# EasyEDA schematic SCH_NetStream_Caravel.json
TITLE: Sheet_1; REV: 1.0; Date: 2026-05-01; Sheet: 1/1; Drawn By: chetansk.241ee214; Company: Your Company
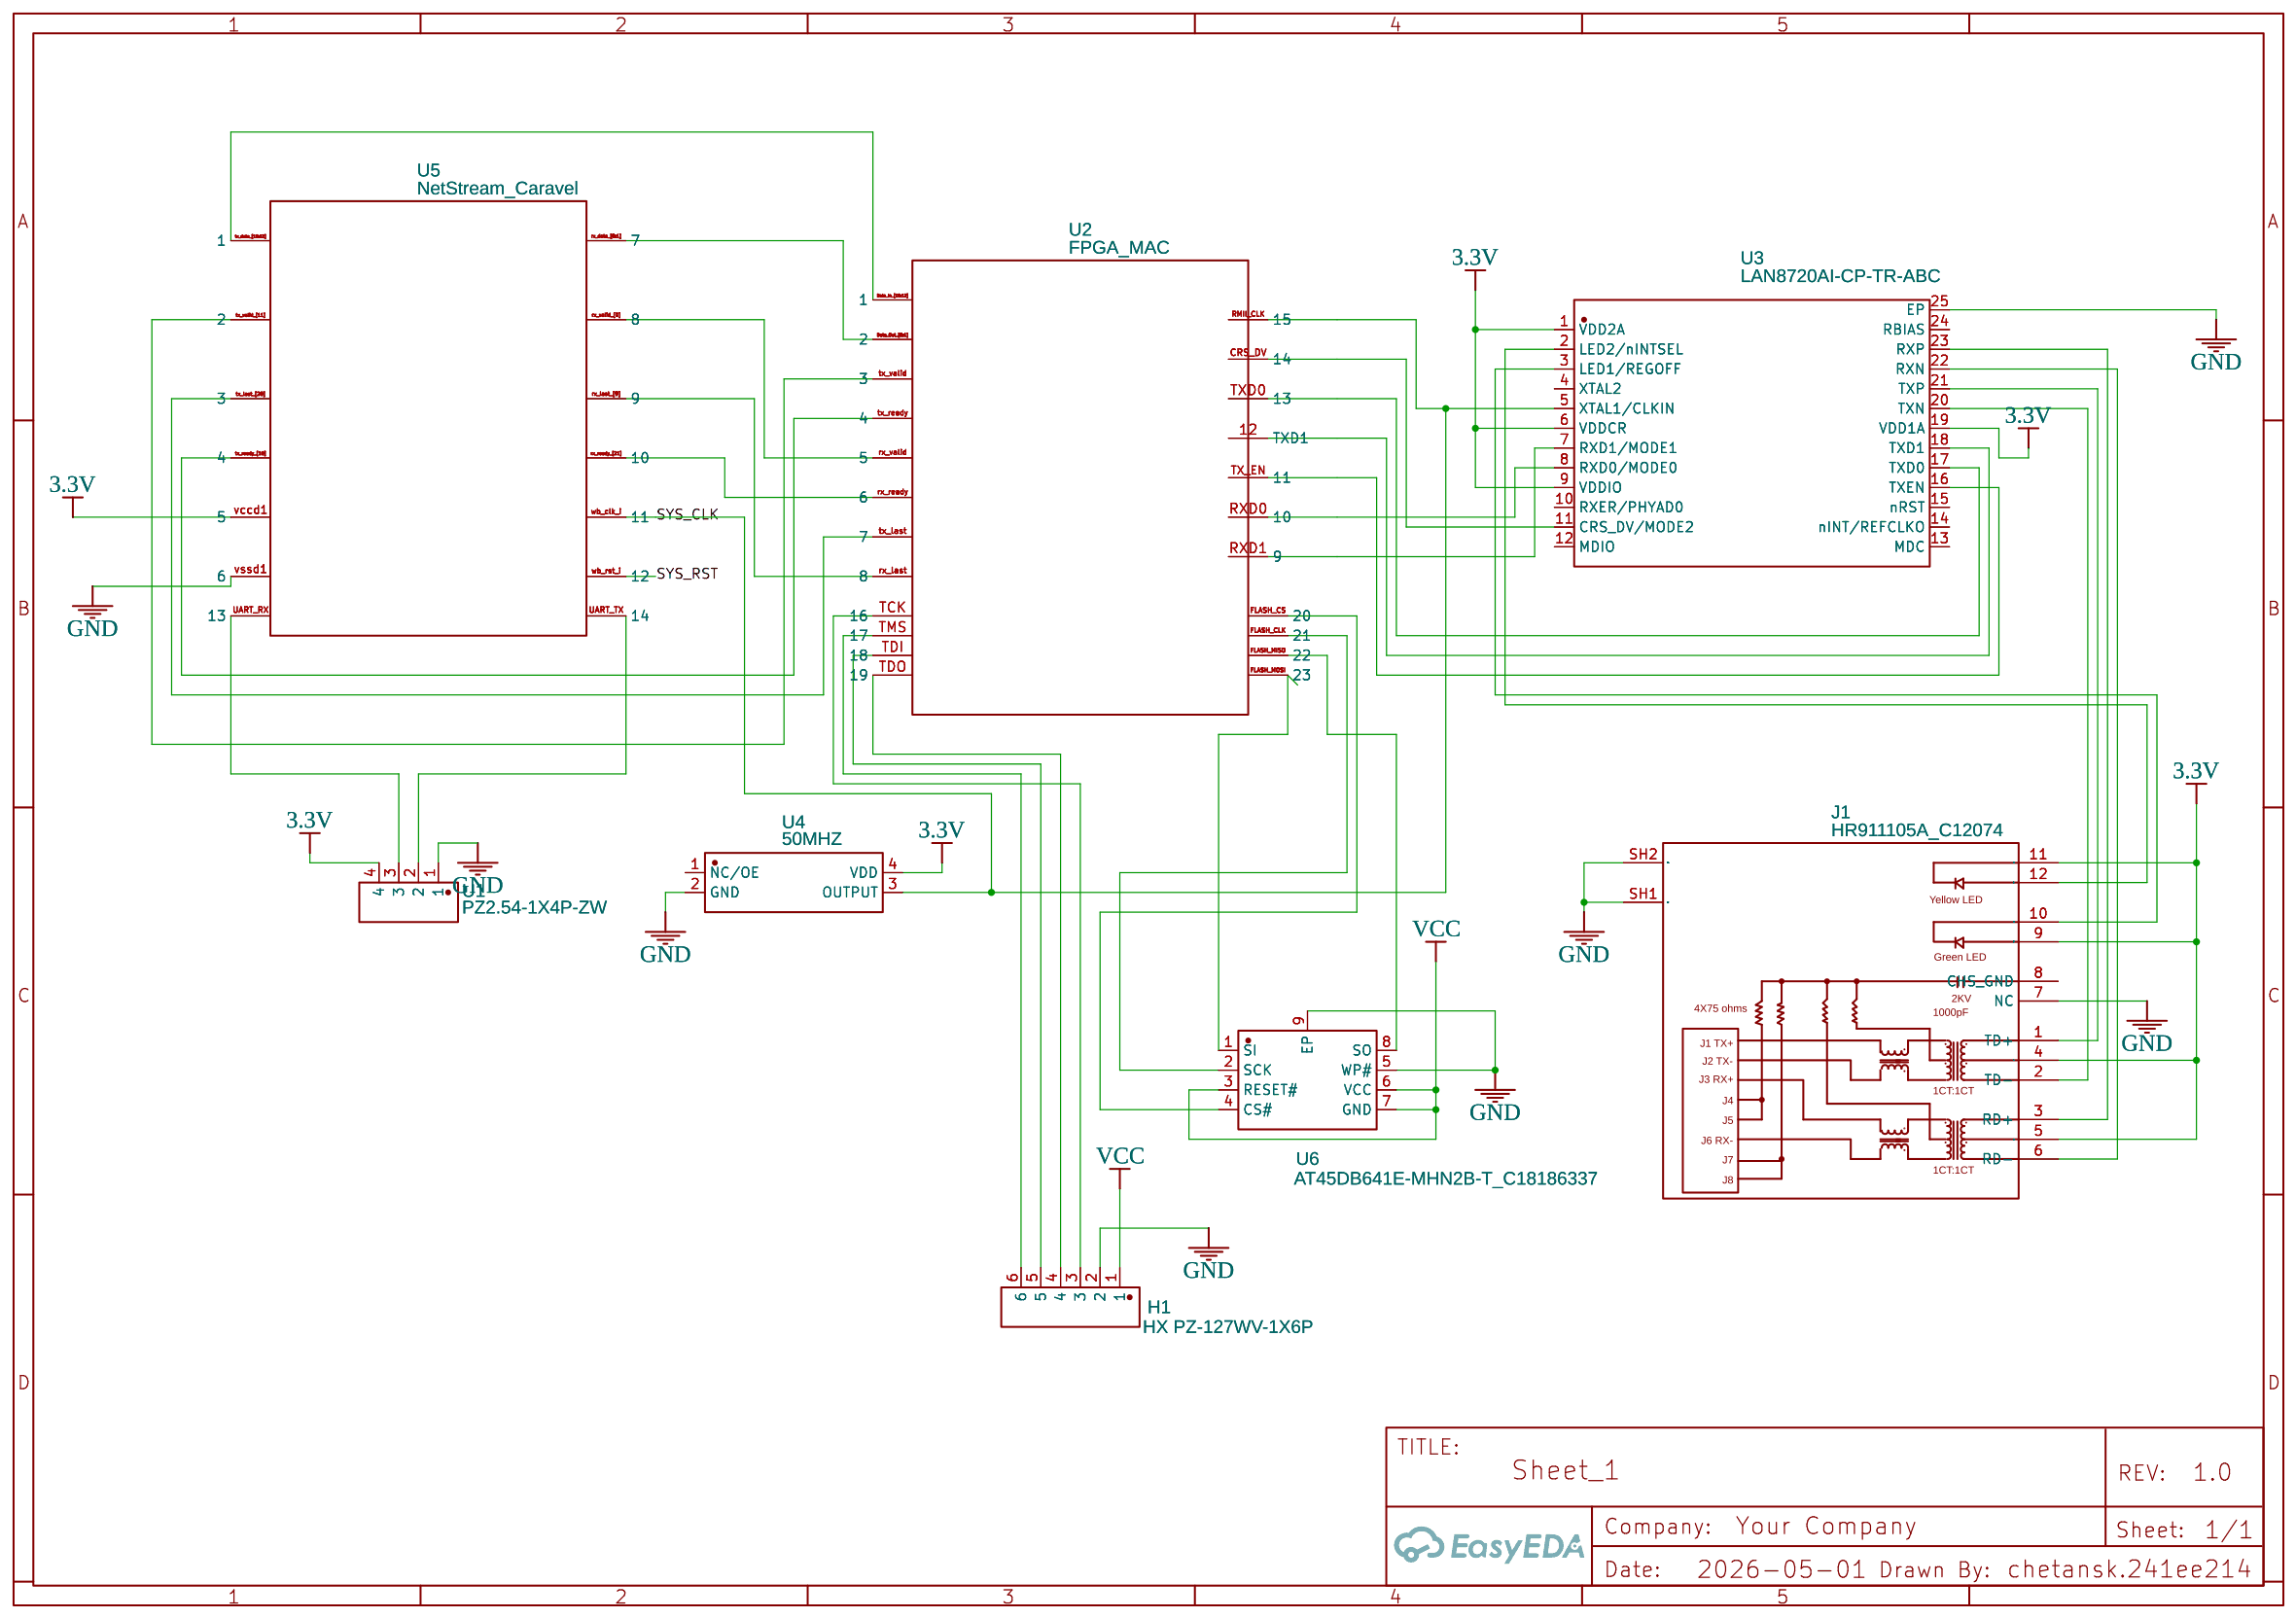
[diagram p0: schematic sheet]

## Parts
H1  HX PZ-127WV-1X6P  [HDR-TH_HX-PZ-127WV-1X6P]
J1  HR911105A_C12074  [RJ45-TH_HR911105A]
U1  PZ2.54-1X4P-ZW  [CONN-TH_PZ2.54-1X4P-ZW]
U2  FPGA_MAC
U3  LAN8720AI-CP-TR-ABC  [QFN-24_L4.0-W4.0-P0.50-TL-EP2.5]
U4  50MHZ  [OSC-SMD_4P-L5.0-W3.2-BL_7CZ-XXXXX]
U5  NetStream_Caravel
U6  AT45DB641E-MHN2B-T_C18186337  [UDFN-8_L6.0-W5.0-P1.27-BL-EP]

## Library data of the parts
H1 = HX PZ-127WV-1X6P: Supplier: LCSC; Supplier Part: C42391506; Manufacturer: hanxia(韩下); Manufacturer Part: HX PZ-127WV-1x6P; Contributor: lcsc
J1 = HR911105A_C12074: Supplier: LCSC; Manufacturer: HANRUN(汉仁); Manufacturer Part: HR911105A; Supplier Part: C12074; JLCPCB Part Class: Extended Part
U1 = PZ2.54-1X4P-ZW: JLCPCB Part Class: Extended Part; Contributor: LCSC; Supplier: LCSC; Supplier Part: C2837836; Manufacturer: null
U2 = FPGA_MAC: Contributor: chetansk.241ee214
U3 = LAN8720AI-CP-TR-ABC: Contributor: lcsc; Supplier: LCSC; Supplier Part: C510876; Manufacturer: MICROCHIP(美国微芯); JLCPCB Part Class: Extended Part
U4 = 50MHZ: Contributor: LCSC; Supplier: LCSC; Supplier Part: C9900008373; Manufacturer: null; Manufacturer Part: 50MHz; JLCPCB Part Class: Extended Part
U5 = NetStream_Caravel: Contributor: chetansk.241ee214
U6 = AT45DB641E-MHN2B-T_C18186337: Supplier: LCSC; Supplier Part: C18186337; Manufacturer: RENESAS(瑞萨)/IDT; Manufacturer Part: AT45DB641E-MHN2B-T; Contributor: lcsc; JLCPCB Part Class: Extended Part

## Nets
3.3V: J1.4 J1.5 J1.9 J1.11 U1.4 U3.1(VDD2A) U3.6(VDDCR) U3.9(VDDIO) U3.19(VDD1A) U4.4(VDD)
GND: H1.2 J1.7(NC) J1.SH1 J1.SH2 U1.1 U3.25(EP) U4.2(GND) U6.5(WP#) U6.9(EP)
VCC: H1.1 U6.3(RESET#) U6.6(VCC) U6.7(GND)
SYS_CLK: U3.5(XTAL1/CLKIN) U4.3(OUTPUT)
Net-(J1-1): J1.1(TD+) U3.21(TXP)
Net-(J1-2): J1.2(TD-) U3.20(TXN)
Net-(J1-3): J1.3(RD+) U3.23(RXP)
Net-(J1-6): J1.6(RD-) U3.22(RXN)
Net-(J1-10): J1.10 U3.3(LED1/REGOFF)
Net-(J1-12): J1.12 U3.2(LED2/nINTSEL)

Not connected (* = marked no-connect by the designer): H1 3 4 5 6; J1 8(CHS GND); U1 2 3; U2 12(TXD1) CRS_DV(14) Data_In [19:12](1) Data_Out [8:1](2) FLASH_CLK(21) FLASH_CS(20) FLASH_MISO(22) FLASH_MOSI(23) RMII_CLK(15) rx_last(8) rx_ready(6) rx_valid(5) RXD0(10) RXD1(9) TCK(16) TDI(18) TDO(19) TMS(17) TX_EN(11) tx_last(7) tx_ready(4) tx_valid(3) TXD0(13); U3 4(XTAL2) 7(RXD1/MODE1) 8(RXD0/MODE0) 10(RXER/PHYAD0) 11(CRS_DV/MODE2) 12(MDIO) 13(MDC) 14(nINT/REFCLKO) 15(nRST) 16(TXEN) 17(TXD0) 18(TXD1) 24(RBIAS); U4 1(NC/OE); U5 rx_data [8:1](7) rx_last [9](9) rx_ready [21](10) rx_valid [0](8) tx_data [19:12](1) tx_last [20](3) tx_ready [10](4) tx_valid [11](2) UART_RX(13) UART_TX(14) vccd1(5) vssd1(6) wb_clk_i(11) wb_rst_i(12); U6 1(SI) 2(SCK) 4(CS#) 8(SO)
